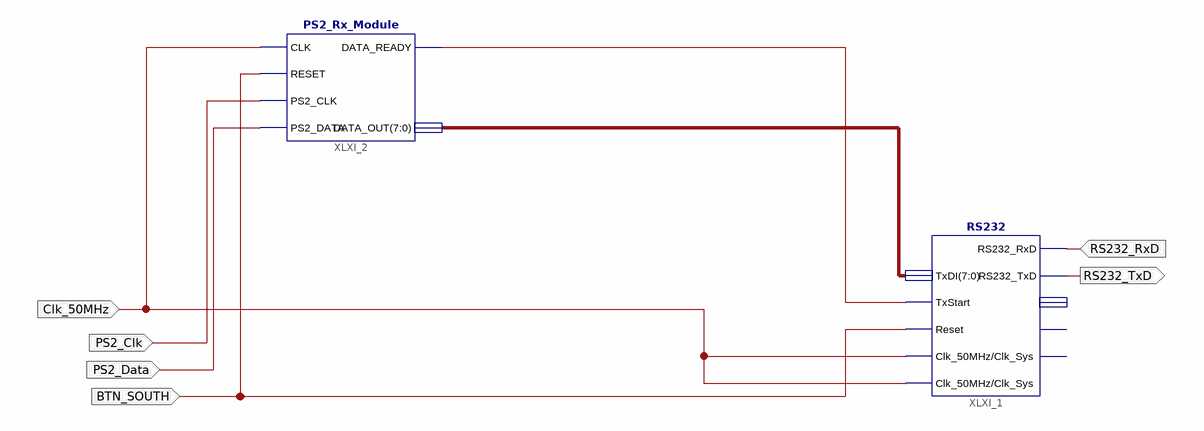
[diagram p0: schematic sheet 1]
// Xilinx ISE schematic testSchem.sch (spartan3e) as structural Verilog: 2 symbols, 6 ports
module testSchem (
  input  RS232_RxD,
  input  Clk_50MHz,
  input  PS2_Clk,
  input  PS2_Data,
  input  BTN_SOUTH,
  output RS232_TxD
);

  wire XLXN_2;
  wire [7:0] XLXN_1;

  PS2_Rx_Module XLXI_2 (
    .CLK(Clk_50MHz), .RESET(BTN_SOUTH), .PS2_CLK(PS2_Clk), .PS2_DATA(PS2_Data), .DATA_READY(XLXN_2),
    .DATA_OUT(XLXN_1));
  RS232 XLXI_1 (
    .Clk_50MHz(Clk_50MHz), .Reset(BTN_SOUTH), .RS232_RxD(RS232_RxD), .TxStart(XLXN_2), .TxDI(XLXN_1),
    .RS232_TxD(RS232_TxD), .Clk_Sys(Clk_50MHz));  // open: TxBusy, RxRdy, RxDO
endmodule
